# EAGLE design h_bridge_v2.1 (EAGLE 7.1.0)
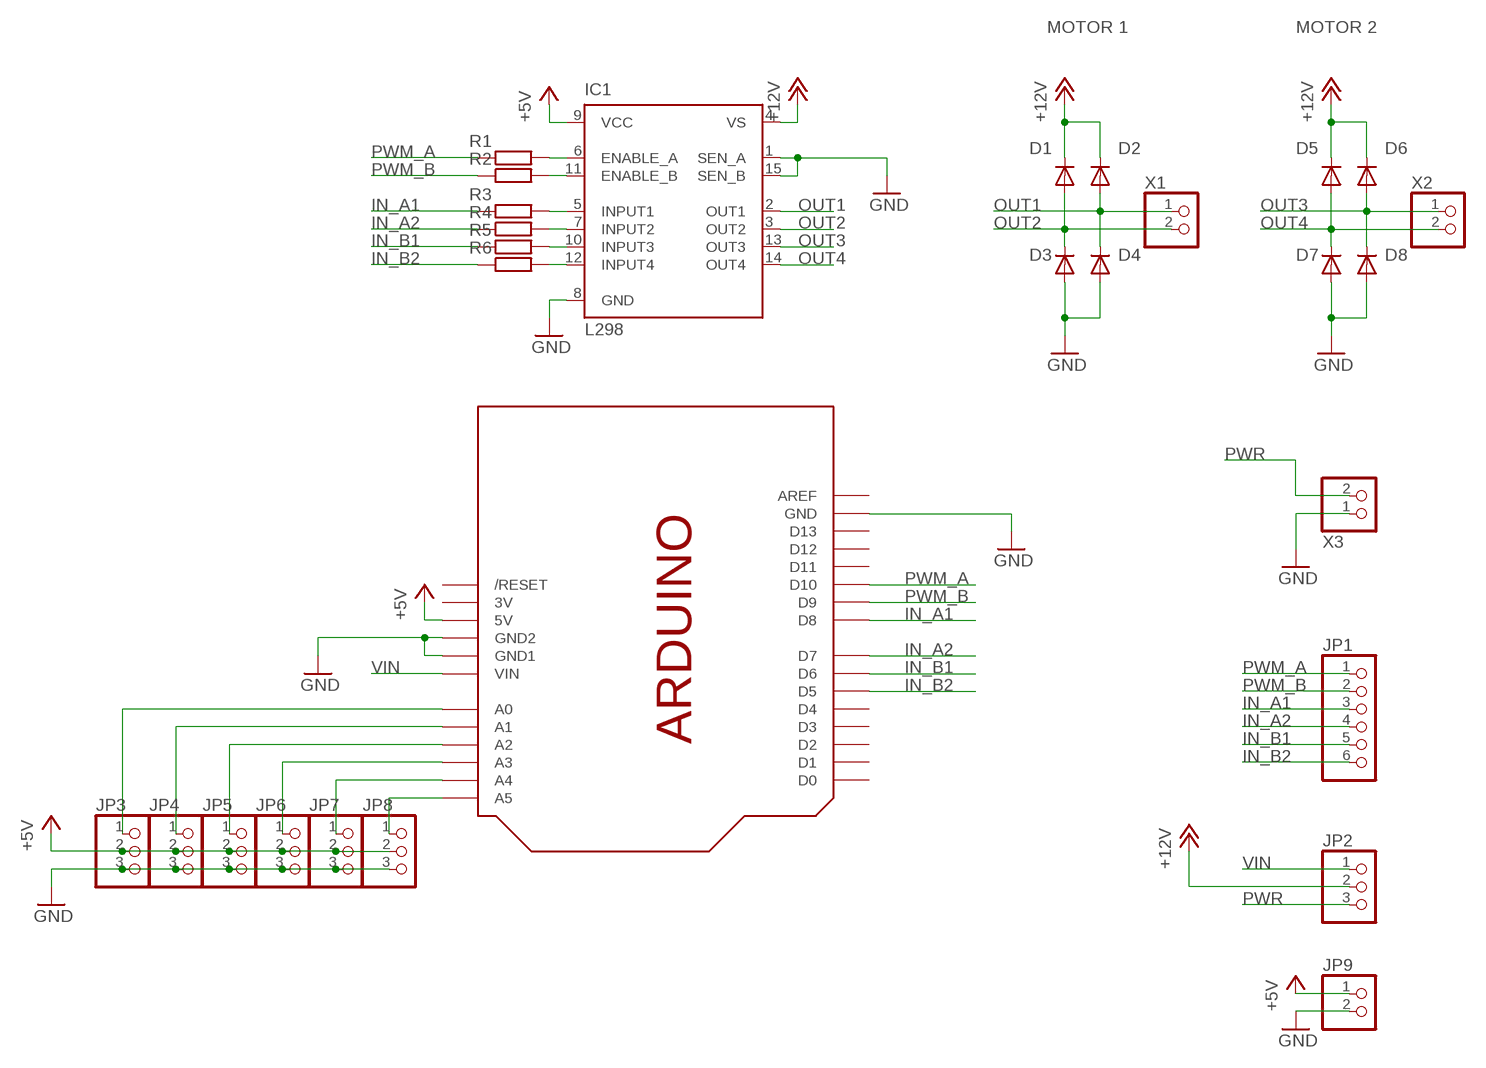
[diagram p0: schematic, sheet 1]

## Parts
D1  1N4004A  [DO41-10]
D2  1N4004A  [DO41-10]
D3  1N4004A  [DO41-10]
D4  1N4004A  [DO41-10]
D5  1N4004A  [DO41-10]
D6  1N4004A  [DO41-10]
D7  1N4004A  [DO41-10]
D8  1N4004A  [DO41-10]
IC1  L298  [MULTIWATT-15]
JP1  PINHD-1X6  [1X06]
JP2  PINHD-1X3180  [1X03]
JP3  PINHD-1X3180  [1X03]
JP4  PINHD-1X3180  [1X03]
JP5  PINHD-1X3180  [1X03]
JP6  PINHD-1X3180  [1X03]
JP7  PINHD-1X3180  [1X03]
JP8  PINHD-1X3180  [1X03]
JP9  PINHD-1X2  [1X02]
R1  R-EU_0207/10  [0207/10]
R2  R-EU_0207/10  [0207/10]
R3  R-EU_0207/10  [0207/10]
R4  R-EU_0207/10  [0207/10]
R5  R-EU_0207/10  [0207/10]
R6  R-EU_0207/10  [0207/10]
U$1  ARDUINO-HOLE  [ARDUINO-HOLE]
X1  W237-102  [W237-102]
X2  W237-102  [W237-102]
X3  W237-102  [W237-102]

## Nets
+5V: IC1.9(VCC) JP3.2 JP4.2 JP5.2 JP6.2 JP7.2 JP8.2 JP9.1 U$1.5V
+12V: D1.C D2.C D5.C D6.C IC1.4(VS) JP2.2
GND: D3.A D4.A D7.A D8.A IC1.1(SEN_A) IC1.8(GND) IC1.15(SEN_B) JP3.3 JP4.3 JP5.3 JP6.3 JP7.3 JP8.3 JP9.2 U$1.GND U$1.GND1 U$1.GND2 X3.1
IN_A1: JP1.3 R3.1 U$1.D8
IN_A2: JP1.4 R4.1 U$1.D7
IN_B1: JP1.5 R5.1 U$1.D6
IN_B2: JP1.6 R6.1 U$1.D5
N$1: IC1.6(ENABLE_A) R1.2
N$2: IC1.11(ENABLE_B) R2.2
N$3: IC1.5(INPUT1) R3.2
N$4: IC1.7(INPUT2) R4.2
N$5: IC1.10(INPUT3) R5.2
N$6: IC1.12(INPUT4) R6.2
N$16: JP3.1 U$1.A0
N$17: JP4.1 U$1.A1
N$18: JP5.1 U$1.A2
N$19: JP6.1 U$1.A3
N$20: JP7.1 U$1.A4
N$21: JP8.1 U$1.A5
OUT1: D2.A D4.C IC1.2(OUT1) X1.1
OUT2: D1.A D3.C IC1.3(OUT2) X1.2
OUT3: D6.A D8.C IC1.13(OUT3) X2.1
OUT4: D5.A D7.C IC1.14(OUT4) X2.2
PWM_A: JP1.1 R1.1 U$1.D10
PWM_B: JP1.2 R2.1 U$1.D9
PWR: JP2.3 X3.2
VIN: JP2.1 U$1.VIN
Unconnected: U$1.AREF U$1.D0 U$1.D1 U$1.D2 U$1.D3 U$1.D4 U$1.D11 U$1.D12 U$1.D13 U$1.RESET(/RESET)

## Notes on the sheet
- MOTOR 1 | MOTOR 2

## Power pins joined to a net without a drawn wire
3V: U$1.3V

## Library data of the parts
D1-D8 = h_bridge_v2:1N4004: DIODE general purpose rectifier, 1 A
IC1 = h_bridge_v2:L298: DUAL FULL-BRIDGE DRIVER; MPN: L298N; OC_FARNELL: 1589425; OC_NEWARK: 32M1527
JP1 = h_bridge_v2:PINHD-1X6: PIN HEADER
JP2-JP8 = h_bridge_v2:PINHD-1X3: PIN HEADER
JP9 = h_bridge_v2:PINHD-1X2: PIN HEADER
R1-R6 = h_bridge_v2:R-EU_: RESISTOR, European symbol
U$1 = h_bridge_v2:ARDUINO: Arduino Diecimila/Duemilanove Make a shield with ease, this package has all the named pins as well as the two mounting drill holes and an outline of the USB and DC power connector. The outline is on the DIMENSION layer, so if your board house uses it they will cut the outline to match. http://www.ladyada.net/library/pcb/eaglelibrary.html
X1-X3 = h_bridge_v2:W237-102: WAGO SCREW CLAMP

## Board
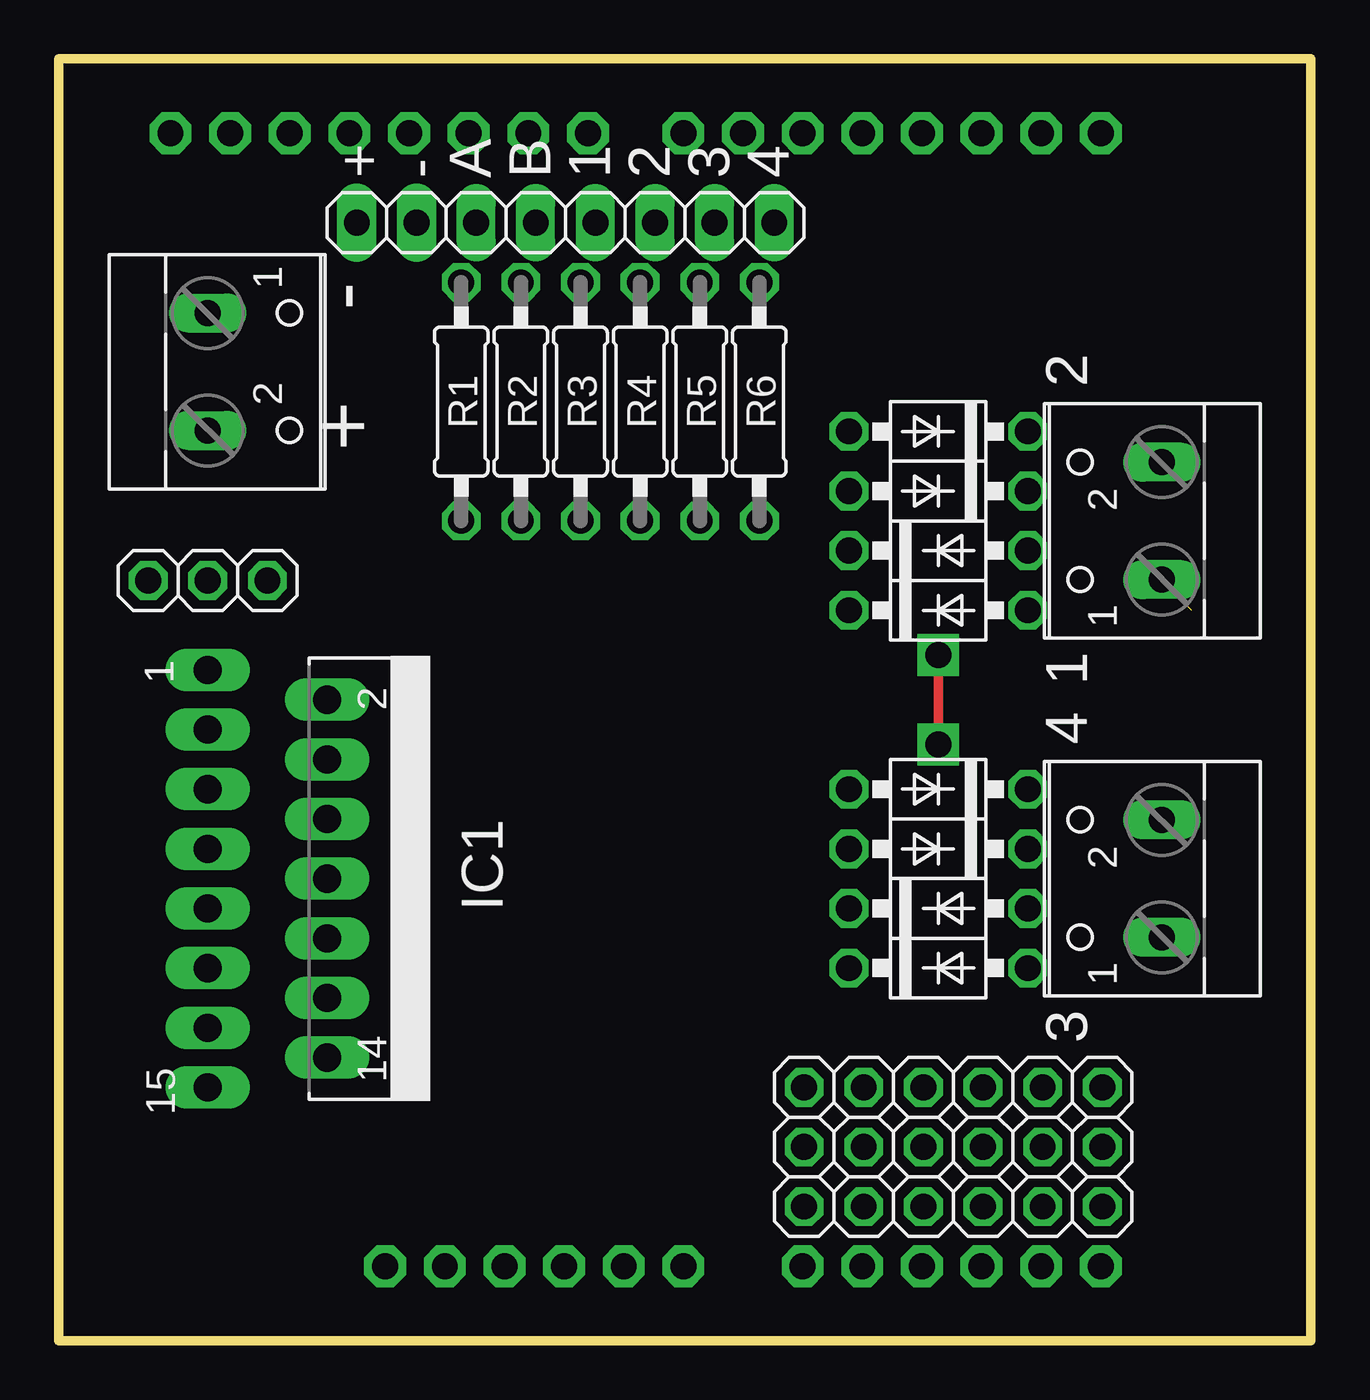
[diagram p1: board, top side]
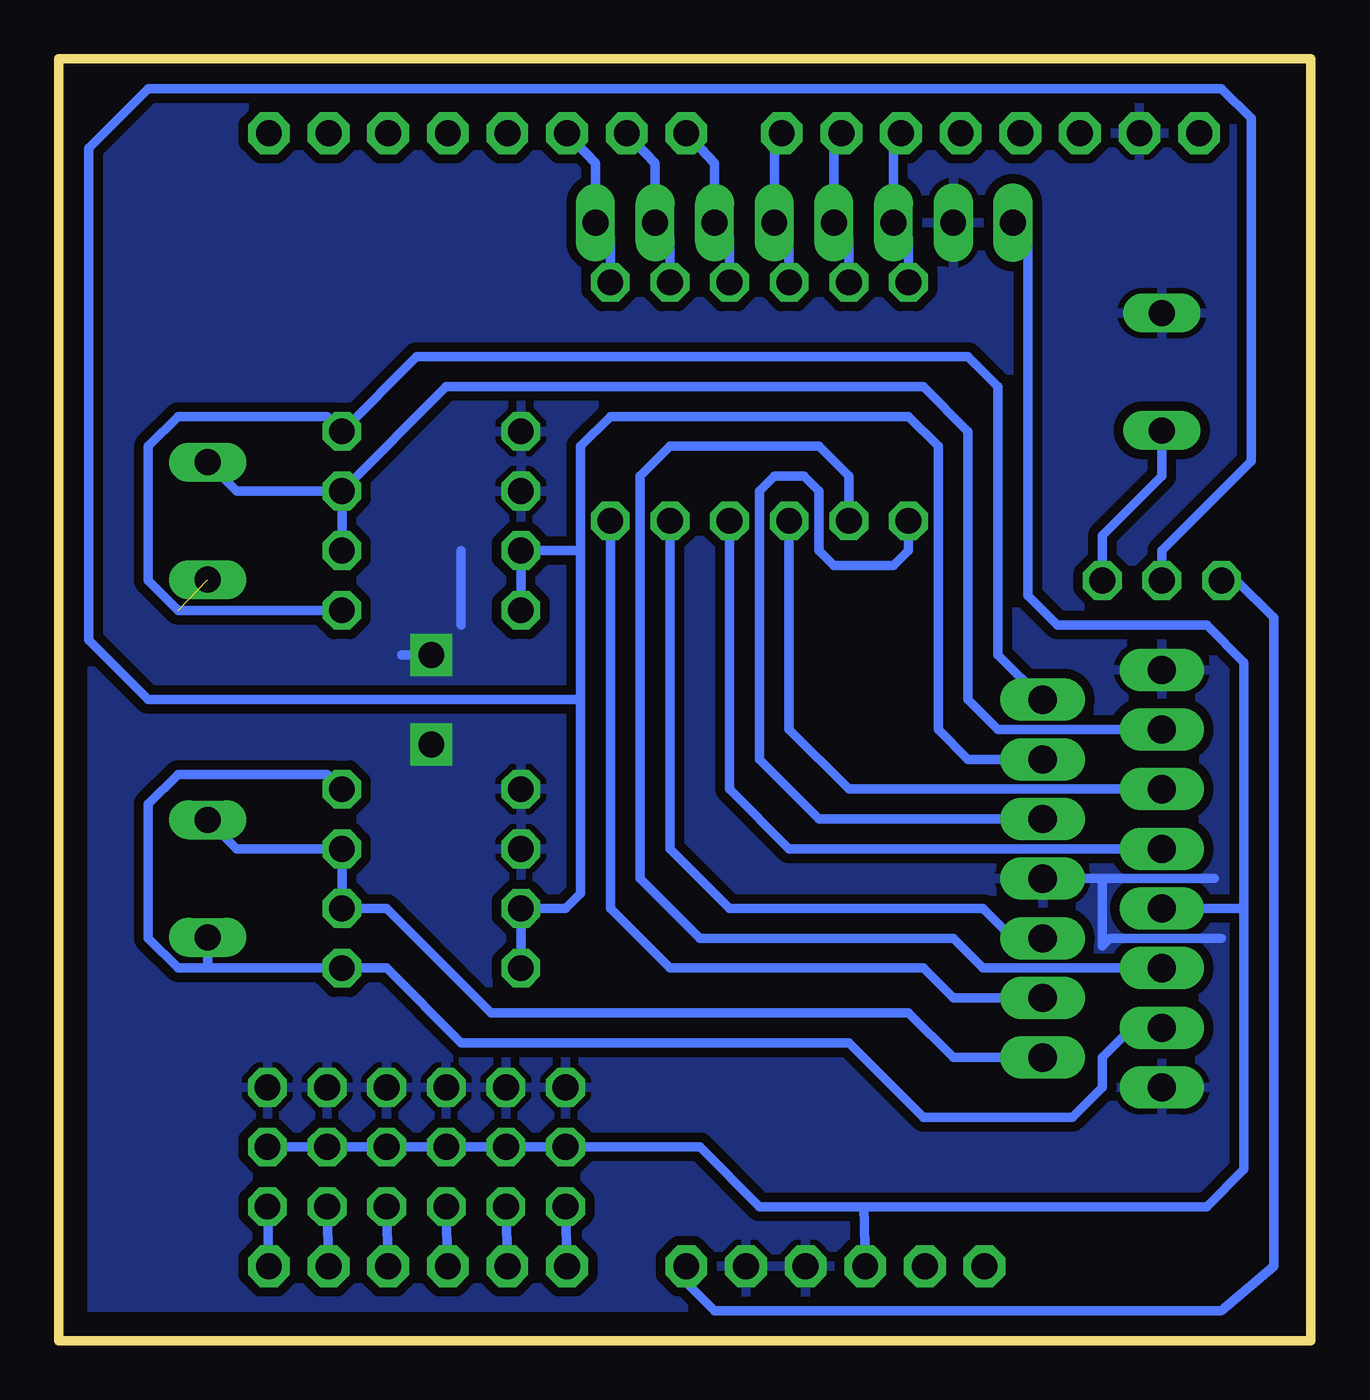
[diagram p2: board, bottom side, seen from below]

Size 53.34 x 54.61 mm. Coordinates in mm from the lower left corner, seen from the top.
Outline: 0,0 53.34,0 53.34,54.61 0,54.61 0,0
Copper layers (1*16): Top 0.035mm / dielectric 1.5mm / Bottom 0.035mm
Design rules "default": minimum track width 10mil, minimum drill 24mil, track to track 8mil, track to pad 8mil, pad to pad 8mil, via to via 8mil, smd to smd 8mil, copper to edge 40mil, drill to drill 8mil, minimum pad ring 10mil, minimum via ring 8mil, stop-mask expansion 4mil, vias tented up to drill 0mil, thermal gap 10mil

### Footprints (pad centres in the part's own frame; a part is rotated, then mirrored left to right if it is on the bottom)
DO41-10 = drill 1.1 octagon: A 3.81,0; C -3.81,0
MULTIWATT-15 = drill 1.2 long: 1 -8.89,-7.62; 2 -7.62,-2.54; 3 -6.35,-7.62; 4 -5.08,-2.54; 5 -3.81,-7.62; 6 -2.54,-2.54; 7 -1.27,-7.62; 8 0,-2.54; 9 1.27,-7.62; 10 2.54,-2.54; 11 3.81,-7.62; 12 5.08,-2.54; 13 6.35,-7.62; 14 7.62,-2.54; 15 8.89,-7.62
1X06 = drill 1.1 long: 1 -6.35,0; 2 -3.81,0; 3 -1.27,0; 4 1.27,0; 5 3.81,0; 6 6.35,0
1X03 = drill 1.1 octagon: 1 -2.54,0; 2 0,0; 3 2.54,0
1X02 = drill 1.1 pad 1.676 long: 1 -1.27,0; 2 1.27,0
0207/10 = drill 1.1 octagon: 1 -5.08,0; 2 5.08,0
ARDUINO-HOLE = drill 1.1 pad 1.778 octagon: 3V 19.05,3.81; 5V 21.59,3.81; A0 34.29,3.81; A1 36.83,3.81; A2 39.37,3.81; A3 41.91,3.81; A4 44.45,3.81; A5 46.99,3.81; AREF 7.366,52.07; D0 46.99,52.07; D1 44.45,52.07; D2 41.91,52.07; D3 39.37,52.07; D4 36.83,52.07; D5 34.29,52.07; D6 31.75,52.07; D7 29.21,52.07; D8 25.146,52.07; D9 22.606,52.07; D10 20.066,52.07; D11 17.526,52.07; D12 14.986,52.07; D13 12.446,52.07; GND 9.906,52.07; GND1 26.67,3.81; GND2 24.13,3.81; RESET 16.51,3.81; VIN 29.21,3.81
W237-102 = drill 1.1 long: 1 -2.5,-1.27; 2 2.5,-1.27

### Placement (x,y rotation side)
D1  37.47,33.66 0 top
D2  37.47,31.11 0 top
D3  37.47,36.2 180 top
D4  37.47,38.73 180 top
D5  37.47,18.41 0 top
D6  37.47,15.88 0 top
D7  37.47,20.95 180 top
D8  37.47,23.49 180 top
IC1  13.97,19.68 270 top
JP1  24.13,47.62 0 top
JP2  6.35,32.39 0 top
JP3  31.75,8.26 90 top
JP4  34.29,8.26 90 top
JP5  36.83,8.26 90 top
JP6  39.37,8.26 90 top
JP7  41.91,8.26 90 top
JP8  44.45,8.26 90 top
JP9  13.97,47.62 0 top
R1  17.14,40.01 270 top
R2  19.68,40.01 270 top
R3  22.23,40.01 270 top
R4  24.77,40.01 270 top
R5  27.3,40.01 270 top
R6  29.84,40.01 270 top
U$1  -2.6,-0.64 0 top
X1  45.72,34.93 90 top
X2  45.72,19.68 90 top
X3  7.62,41.27 270 top

### Tracks (layer width: path | path; a pad name or v marks a point on that pad's centre or on a via)
+5V
  Bottom 0.406: 19.05,5.71 U$1.5V | 19.05,5.71 4.45,5.71 2.86,7.3 2.86,18.41 | 2.86,18.41 IC1.9 | JP8.2 JP7.2 JP6.2 JP5.2 JP4.2 JP3.2 26.04,8.26 23.5,5.71 19.05,5.71 | JP9.1 12.06,46.99 12.06,31.75 10.79,30.48 4.45,30.48 2.86,28.89 2.86,18.41
+12V
  Bottom 0.406: 31.11,27.3 49.53,27.3 52.07,29.84 52.07,50.8 49.53,53.34 3.81,53.34 2.54,52.07 2.54,37.47 6.35,33.66 JP2.2 | IC1.4 14.61,24.76 15.88,26.04 15.88,38.1 17.14,39.37 29.84,39.37 31.11,38.1 31.11,33.66 | D6.C D5.C 31.75,18.41 31.11,19.05 31.11,27.3 | 31.11,33.66 31.11,27.3 | D2.C D1.C 31.11,33.66
GND  (via drill 1.1 pad 1.78)
  Top 0.406: v37.47,25.4 v37.47,29.21
  Bottom 0.406: IC1.8 8.89,19.68 | 4.13,19.68 8.89,19.68 | 8.89,19.68 8.89,16.83 8.57,17.14 3.81,17.14 | v37.47,29.21 38.73,29.21 | 36.2,30.48 36.2,33.66
  pour Bottom (isolate 0.406): -1.91,55.88 -1.91,-1.27 55.24,-0.95 55.24,56.2
IN_A1
  Bottom 0.406: U$1.D8 22.86,51.18 JP1.3 22.23,46.99 R3.1
IN_A2
  Bottom 0.406: U$1.D7 25.4,50.16 JP1.4 24.77,46.99 R4.1
IN_B1
  Bottom 0.406: U$1.D6 27.94,50.16 JP1.5 27.3,46.99 R5.1
IN_B2
  Bottom 0.406: U$1.D5 30.48,50.16 JP1.6 29.84,46.99 R6.1
N$1
  Bottom 0.406: IC1.6 20.95,22.22 23.5,24.76 23.5,36.2 22.86,36.83 21.59,36.83 20.95,36.2 20.95,33.66 20.32,33.02 17.78,33.02 17.14,33.66 R1.2
N$2
  Bottom 0.406: R2.2 19.68,36.83 20.95,38.1 27.3,38.1 28.57,36.83 28.57,19.68 26.04,17.14 15.24,17.14 13.97,15.88 IC1.11
N$3
  Bottom 0.406: IC1.5 19.68,23.49 22.23,26.04 R3.2
N$4
  Bottom 0.406: R4.2 24.77,23.49 22.23,20.95 IC1.7
N$5
  Bottom 0.406: R5.2 27.3,20.95 24.77,18.41 13.97,18.41 12.7,17.14 IC1.10
N$6
  Bottom 0.406: R6.2 29.84,18.41 27.3,15.88 16.51,15.88 15.24,14.61 IC1.12
N$16
  Bottom 0.406: U$1.A0 JP3.1
N$17
  Bottom 0.406: U$1.A1 JP4.1
N$18
  Bottom 0.406: U$1.A2 JP5.1
N$19
  Bottom 0.406: U$1.A3 JP6.1
N$20
  Bottom 0.406: U$1.A4 JP7.1
N$21
  Bottom 0.406: U$1.A5 JP8.1
OUT1  (1 unrouted)
  Bottom 0.406: IC1.2 13.34,29.21 13.34,40.64 14.61,41.91 38.1,41.91 D4.C 41.91,39.37 48.26,39.37 49.53,38.1 49.53,32.39 48.26,31.11 D2.A
OUT2
  Bottom 0.406: IC1.3 13.34,26.04 14.61,27.3 14.61,38.73 16.51,40.64 36.83,40.64 D3.C | D3.C D1.A | X1.2 45.76,36.2 D3.C
OUT3
  Bottom 0.406: IC1.13 7.62,13.34 8.89,12.06 8.89,10.79 10.16,9.53 16.51,9.53 19.68,12.7 36.2,12.7 39.37,15.88 D6.A 46.99,15.88 | 46.99,15.88 48.26,15.88 49.53,17.14 49.53,22.86 48.26,24.13 41.91,24.13 D8.C | 46.99,15.88 X2.1
OUT4
  Bottom 0.406: IC1.14 15.24,12.06 17.14,13.97 34.92,13.97 39.37,18.41 D5.A D7.C 45.76,20.95 X2.2
PWM_A
  Bottom 0.406: U$1.D10 17.78,51.18 JP1.1 17.14,46.99 R1.1
PWM_B
  Bottom 0.406: U$1.D9 20.32,51.18 JP1.2 19.68,46.99 R2.1
PWR
  Bottom 0.406: JP2.3 8.89,34.29 6.35,36.83 X3.2
VIN
  Bottom 0.406: JP2.1 3.17,32.39 1.59,30.8 1.59,3.17 3.81,1.27 25.4,1.27 26.67,2.54 U$1.VIN

### Text on the board
tNames: + | - | A | B | 1 | 2 | 3 | 4 | - | + | 2 | 1 | 4 | 3
tValues: PWR | A | Vin | Pwr | B